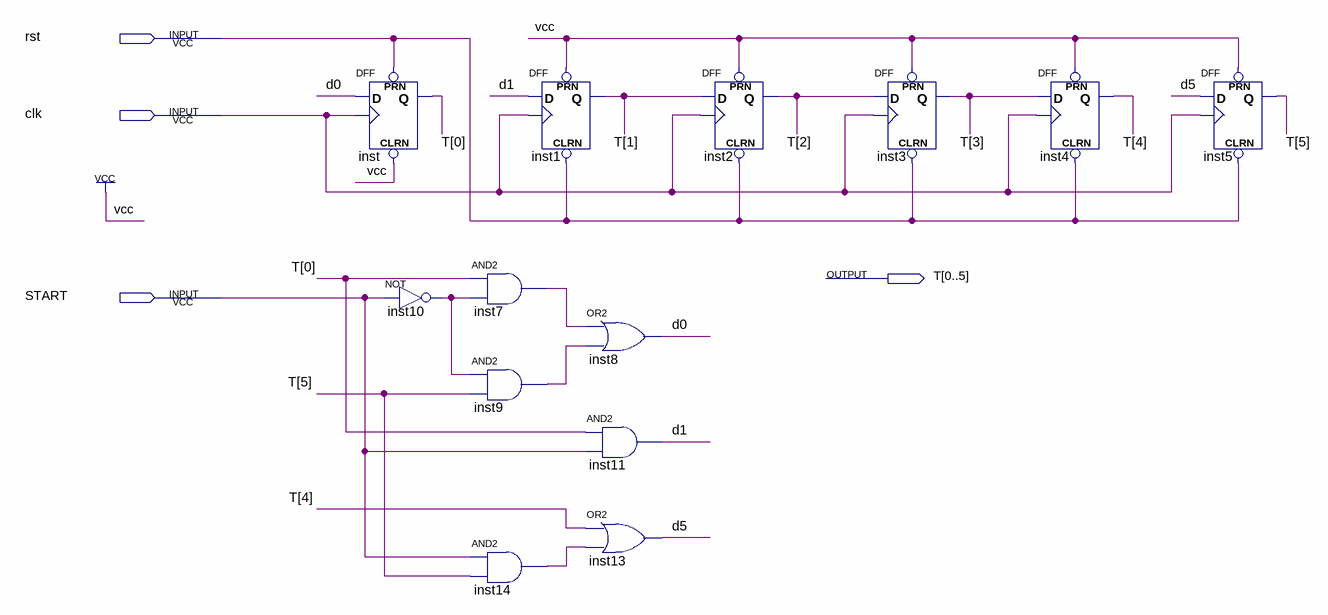
[diagram p0: schematic sheet]
// Quartus schematic state_gen.bdf as structural Verilog: 13 symbols, 4 pins
module state_gen (
  input  rst,
  input  clk,
  input  START,
  output [0:5] T
);

  wire d0, d1, d5, inst7_out, inst9_out, inst10_out, inst14_out;

  DFF inst (.CLRN(1'b1), .CLK(clk), .D(d0), .PRN(rst), .Q(T[0]));
  not inst10 (inst10_out, START);
  DFF inst1 (.CLRN(rst), .CLK(clk), .D(d1), .PRN(1'b1), .Q(T[1]));
  and inst7 (inst7_out, T[0], inst10_out);
  and inst9 (inst9_out, inst10_out, T[5]);
  and inst14 (inst14_out, START, T[5]);
  or inst8 (d0, inst7_out, inst9_out);
  and inst11 (d1, T[0], START);
  or inst13 (d5, T[4], inst14_out);
  DFF inst2 (.CLRN(rst), .CLK(clk), .D(T[1]), .PRN(1'b1), .Q(T[2]));
  DFF inst3 (.CLRN(rst), .CLK(clk), .D(T[2]), .PRN(1'b1), .Q(T[3]));
  DFF inst4 (.CLRN(rst), .CLK(clk), .D(T[3]), .PRN(1'b1), .Q(T[4]));
  DFF inst5 (.CLRN(rst), .CLK(clk), .D(d5), .PRN(1'b1), .Q(T[5]));
endmodule
